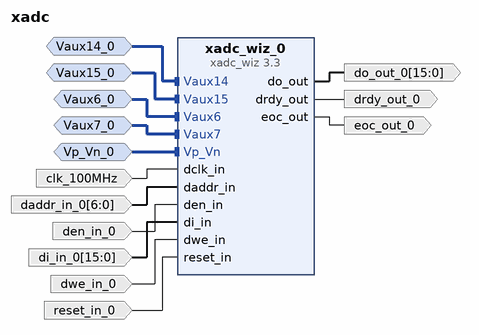
[diagram p0: block diagram of the top level]
# Vivado block design xadc, xc7z010clg400-1, Vivado 2022.2
create_bd_design xadc

create_bd_intf_port -mode Slave -vlnv xilinx.com:interface:diff_analog_io_rtl:1.0 Vaux14_0
create_bd_intf_port -mode Slave -vlnv xilinx.com:interface:diff_analog_io_rtl:1.0 Vaux15_0
create_bd_intf_port -mode Slave -vlnv xilinx.com:interface:diff_analog_io_rtl:1.0 Vaux6_0
create_bd_intf_port -mode Slave -vlnv xilinx.com:interface:diff_analog_io_rtl:1.0 Vaux7_0
create_bd_intf_port -mode Slave -vlnv xilinx.com:interface:diff_analog_io_rtl:1.0 Vp_Vn_0
create_bd_port -dir I -type clk clk_100MHz
set_property -dict {CONFIG.FREQ_HZ 100000000} [get_bd_ports clk_100MHz]
create_bd_port -dir O eoc_out_0
create_bd_port -dir I -type rst reset_in_0
set_property -dict {CONFIG.POLARITY ACTIVE_HIGH} [get_bd_ports reset_in_0]
create_bd_port -dir O -from 15 -to 0 do_out_0
create_bd_port -dir I -from 15 -to 0 di_in_0
create_bd_port -dir I den_in_0
create_bd_port -dir I -from 6 -to 0 daddr_in_0
create_bd_port -dir O drdy_out_0
create_bd_port -dir I dwe_in_0

create_bd_cell -type ip -vlnv xilinx.com:ip:xadc_wiz:3.3 xadc_wiz_0
set_property -dict [list \
  CONFIG.ACQUISITION_TIME_VAUXP6_VAUXN6 false \
  CONFIG.ADC_CONVERSION_RATE 1000 \
  CONFIG.CHANNEL_ENABLE_VAUXP0_VAUXN0 false \
  CONFIG.CHANNEL_ENABLE_VAUXP14_VAUXN14 true \
  CONFIG.CHANNEL_ENABLE_VAUXP15_VAUXN15 true \
  CONFIG.CHANNEL_ENABLE_VAUXP6_VAUXN6 true \
  CONFIG.CHANNEL_ENABLE_VAUXP7_VAUXN7 true \
  CONFIG.CHANNEL_ENABLE_VP_VN true \
  CONFIG.DCLK_FREQUENCY 125 \
  CONFIG.ENABLE_CALIBRATION_AVERAGING true \
  CONFIG.ENABLE_CONVST true \
  CONFIG.ENABLE_DCLK true \
  CONFIG.ENABLE_DRP false \
  CONFIG.ENABLE_EXTERNAL_MUX false \
  CONFIG.ENABLE_RESET true \
  CONFIG.ENABLE_VCCDDRO_ALARM false \
  CONFIG.ENABLE_VCCPAUX_ALARM false \
  CONFIG.ENABLE_VCCPINT_ALARM false \
  CONFIG.EXTERNAL_MUX_CHANNEL VP_VN \
  CONFIG.INTERFACE_SELECTION ENABLE_DRP \
  CONFIG.NUM_WAVE 2 \
  CONFIG.OT_ALARM false \
  CONFIG.SEQUENCER_MODE Continuous \
  CONFIG.SINGLE_CHANNEL_SELECTION TEMPERATURE \
  CONFIG.STIMULUS_FREQ 1.0 \
  CONFIG.TIMING_MODE Continuous \
  CONFIG.USER_TEMP_ALARM false \
  CONFIG.VCCAUX_ALARM false \
  CONFIG.VCCINT_ALARM false \
  CONFIG.WAVEFORM_TYPE SIN \
  CONFIG.XADC_STARUP_SELECTION channel_sequencer \
] [get_bd_cells xadc_wiz_0]

# ---- connections ----

connect_bd_intf_net -intf_net Vaux14_0_1 [get_bd_intf_ports Vaux14_0] [get_bd_intf_pins xadc_wiz_0/Vaux14]
connect_bd_intf_net -intf_net Vaux15_0_1 [get_bd_intf_ports Vaux15_0] [get_bd_intf_pins xadc_wiz_0/Vaux15]
connect_bd_intf_net -intf_net Vaux6_0_1 [get_bd_intf_ports Vaux6_0] [get_bd_intf_pins xadc_wiz_0/Vaux6]
connect_bd_intf_net -intf_net Vaux7_0_1 [get_bd_intf_ports Vaux7_0] [get_bd_intf_pins xadc_wiz_0/Vaux7]
connect_bd_intf_net -intf_net Vp_Vn_0_1 [get_bd_intf_ports Vp_Vn_0] [get_bd_intf_pins xadc_wiz_0/Vp_Vn]
connect_bd_net [get_bd_ports clk_100MHz] [get_bd_pins xadc_wiz_0/dclk_in]
connect_bd_net -net daddr_in_0_1 [get_bd_ports daddr_in_0] [get_bd_pins xadc_wiz_0/daddr_in]
connect_bd_net -net den_in_0_1 [get_bd_ports den_in_0] [get_bd_pins xadc_wiz_0/den_in]
connect_bd_net -net di_in_0_1 [get_bd_ports di_in_0] [get_bd_pins xadc_wiz_0/di_in]
connect_bd_net -net dwe_in_0_1 [get_bd_ports dwe_in_0] [get_bd_pins xadc_wiz_0/dwe_in]
connect_bd_net -net reset_in_0_1 [get_bd_ports reset_in_0] [get_bd_pins xadc_wiz_0/reset_in]
connect_bd_net [get_bd_pins xadc_wiz_0/do_out] [get_bd_ports do_out_0]
connect_bd_net [get_bd_pins xadc_wiz_0/drdy_out] [get_bd_ports drdy_out_0]
connect_bd_net [get_bd_pins xadc_wiz_0/eoc_out] [get_bd_ports eoc_out_0]

validate_bd_design
save_bd_design
